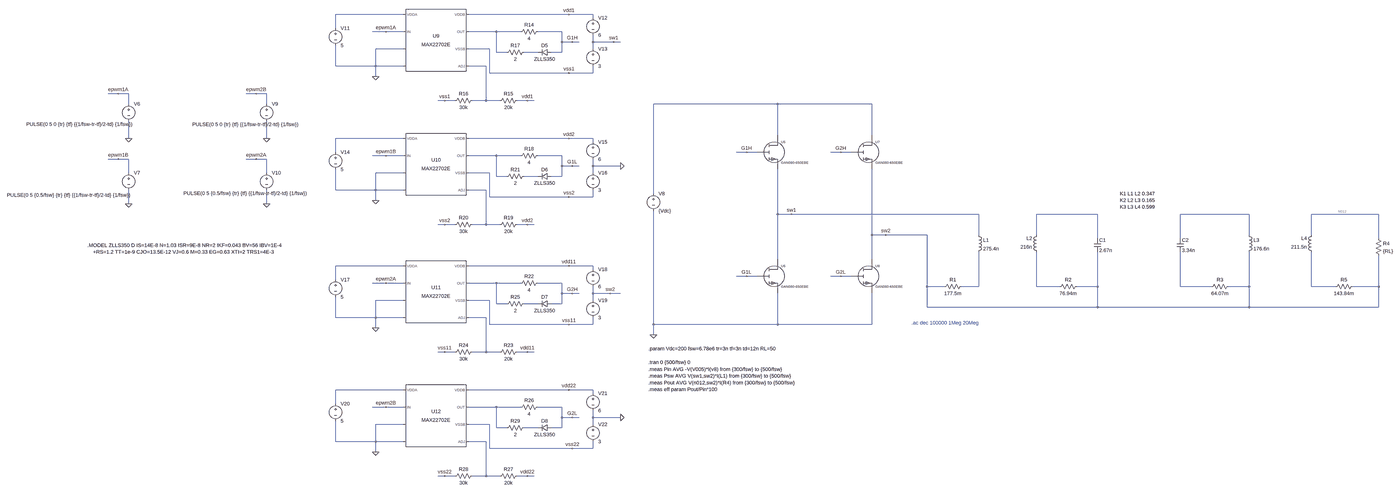
[diagram p0: schematic eta_coil_sim.asc, whole sheet]
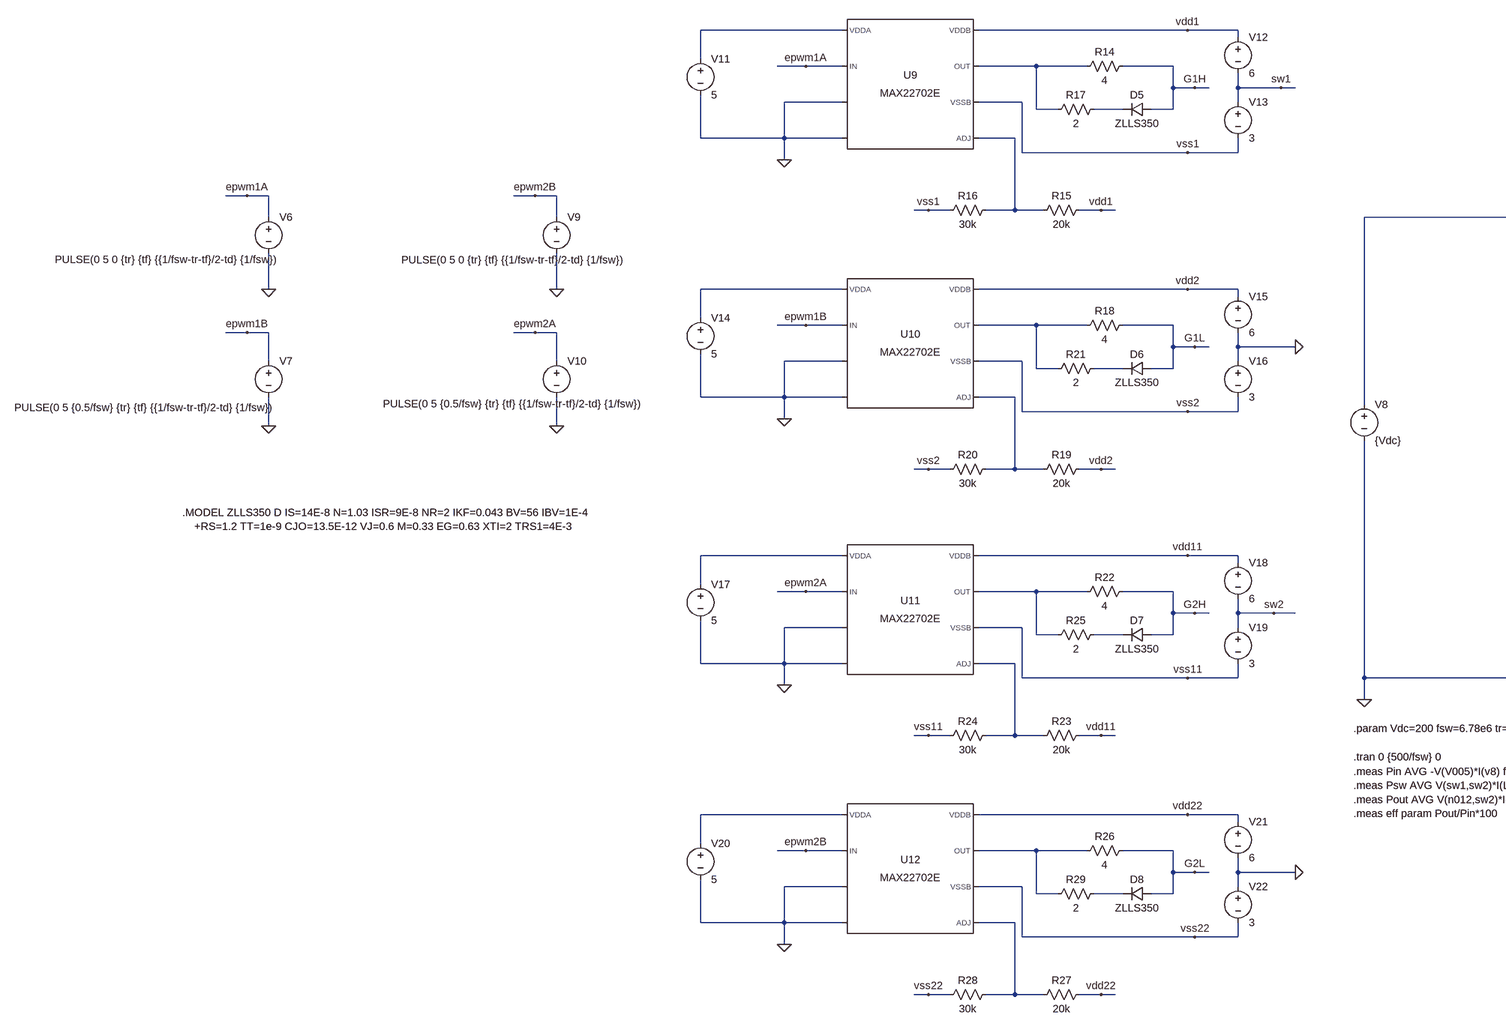
[diagram p1: schematic eta_coil_sim.asc, part, row 1 of 1, column 1 of 2]
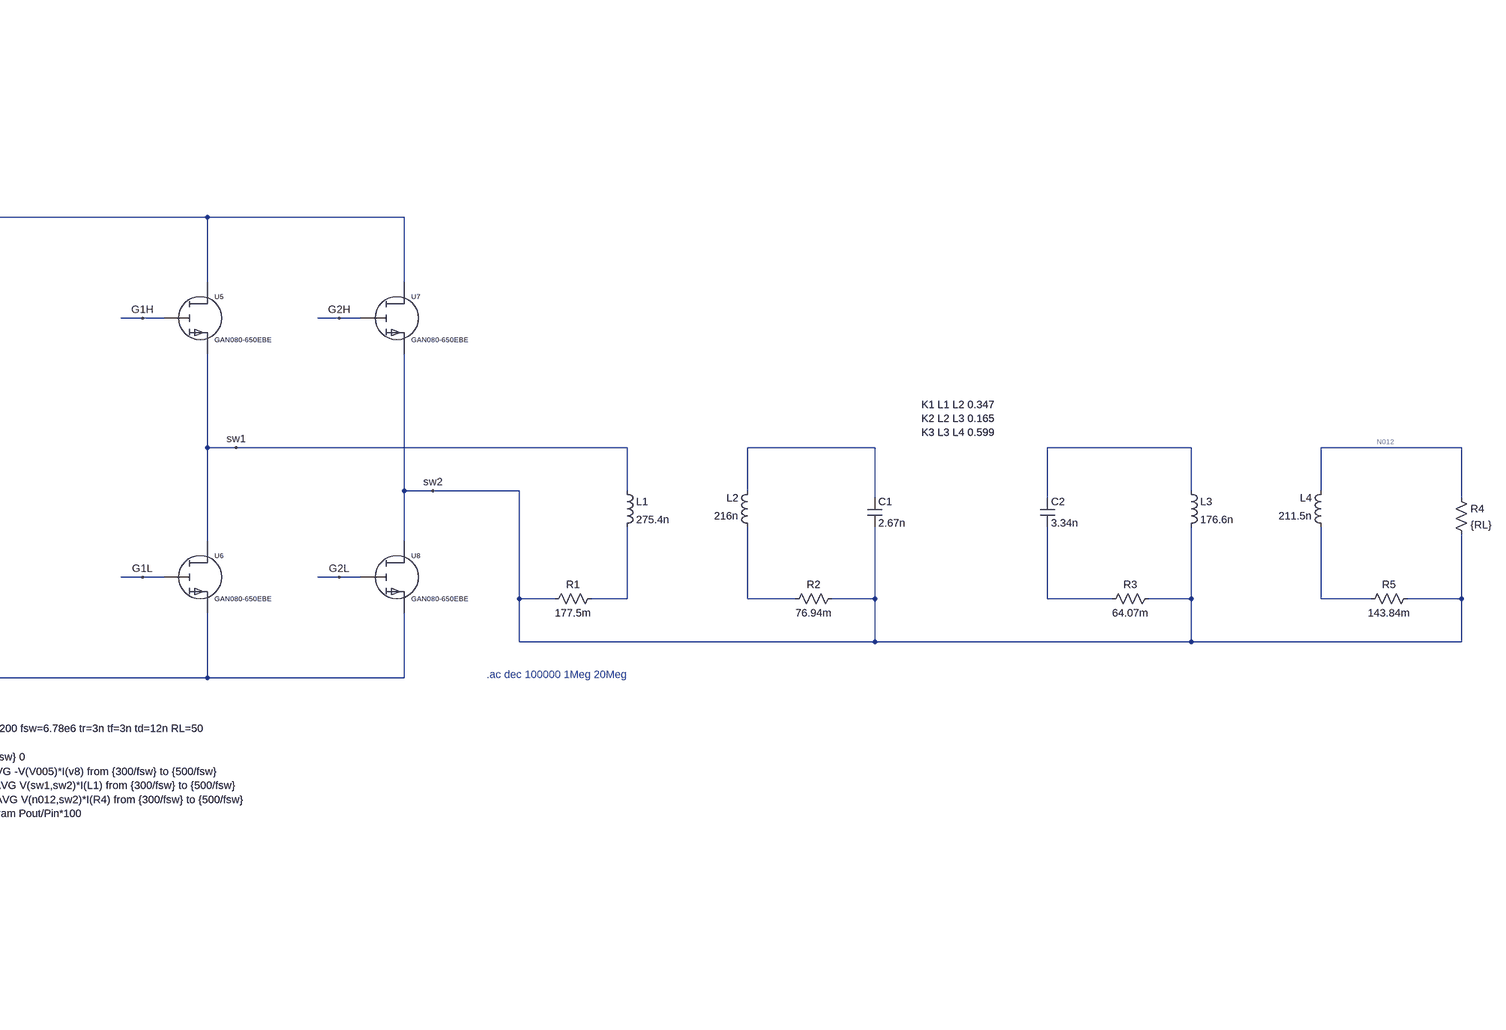
[diagram p2: schematic eta_coil_sim.asc, part, row 1 of 1, column 2 of 2]
eta_coil_sim.asc, the LTspice schematic file:
Version 4.1
SHEET 1 2552 808
WIRE -3744 -2960 -4080 -2960
WIRE -2976 -2960 -3440 -2960
WIRE -2864 -2960 -2976 -2960
WIRE -2864 -2944 -2864 -2960
WIRE -4080 -2896 -4080 -2960
WIRE -3824 -2880 -3888 -2880
WIRE -3744 -2880 -3824 -2880
WIRE -3312 -2880 -3440 -2880
WIRE -3200 -2880 -3312 -2880
WIRE -3008 -2880 -3120 -2880
WIRE -3008 -2832 -3008 -2880
WIRE -2960 -2832 -3008 -2832
WIRE -2928 -2832 -2960 -2832
WIRE -2864 -2832 -2864 -2864
WIRE -2768 -2832 -2864 -2832
WIRE -2736 -2832 -2768 -2832
WIRE -3744 -2800 -3872 -2800
WIRE -3344 -2800 -3440 -2800
WIRE -2864 -2800 -2864 -2832
WIRE -3312 -2784 -3312 -2880
WIRE -3264 -2784 -3312 -2784
WIRE -3120 -2784 -3184 -2784
WIRE -3008 -2784 -3008 -2832
WIRE -3008 -2784 -3056 -2784
WIRE -4080 -2720 -4080 -2816
WIRE -3872 -2720 -3872 -2800
WIRE -3872 -2720 -4080 -2720
WIRE -3744 -2720 -3872 -2720
WIRE -3360 -2720 -3440 -2720
WIRE -3344 -2688 -3344 -2800
WIRE -2976 -2688 -3344 -2688
WIRE -2864 -2688 -2864 -2720
WIRE -2864 -2688 -2976 -2688
WIRE -3872 -2672 -3872 -2720
WIRE -5456 -2592 -5504 -2592
WIRE -5408 -2592 -5456 -2592
WIRE -4816 -2592 -4864 -2592
WIRE -4768 -2592 -4816 -2592
WIRE -3552 -2560 -3584 -2560
WIRE -3504 -2560 -3552 -2560
WIRE -3360 -2560 -3360 -2720
WIRE -3360 -2560 -3424 -2560
WIRE -3296 -2560 -3360 -2560
WIRE -3168 -2560 -3216 -2560
WIRE -3136 -2560 -3168 -2560
WIRE -5408 -2544 -5408 -2592
WIRE -4768 -2544 -4768 -2592
WIRE -1824 -2544 -2400 -2544
WIRE -1280 -2544 -1824 -2544
WIRE -1824 -2400 -1824 -2544
WIRE -1280 -2400 -1280 -2544
WIRE -5408 -2384 -5408 -2464
WIRE -4768 -2384 -4768 -2464
WIRE -3744 -2384 -4080 -2384
WIRE -2976 -2384 -3440 -2384
WIRE -2864 -2384 -2976 -2384
WIRE -2864 -2368 -2864 -2384
WIRE -4080 -2320 -4080 -2384
WIRE -1968 -2320 -2016 -2320
WIRE -1920 -2320 -1968 -2320
WIRE -1424 -2320 -1472 -2320
WIRE -1376 -2320 -1424 -2320
WIRE -3824 -2304 -3888 -2304
WIRE -3744 -2304 -3824 -2304
WIRE -3312 -2304 -3440 -2304
WIRE -3200 -2304 -3312 -2304
WIRE -3008 -2304 -3120 -2304
WIRE -5456 -2288 -5504 -2288
WIRE -5408 -2288 -5456 -2288
WIRE -4816 -2288 -4864 -2288
WIRE -4768 -2288 -4816 -2288
WIRE -3008 -2256 -3008 -2304
WIRE -2960 -2256 -3008 -2256
WIRE -2928 -2256 -2960 -2256
WIRE -2864 -2256 -2864 -2288
WIRE -2736 -2256 -2864 -2256
WIRE -5408 -2224 -5408 -2288
WIRE -4768 -2224 -4768 -2288
WIRE -3744 -2224 -3872 -2224
WIRE -3344 -2224 -3440 -2224
WIRE -2864 -2224 -2864 -2256
WIRE -3312 -2208 -3312 -2304
WIRE -3264 -2208 -3312 -2208
WIRE -3120 -2208 -3184 -2208
WIRE -3008 -2208 -3008 -2256
WIRE -3008 -2208 -3056 -2208
WIRE -4080 -2144 -4080 -2240
WIRE -3872 -2144 -3872 -2224
WIRE -3872 -2144 -4080 -2144
WIRE -3744 -2144 -3872 -2144
WIRE -3360 -2144 -3440 -2144
WIRE -2400 -2128 -2400 -2544
WIRE -3344 -2112 -3344 -2224
WIRE -2976 -2112 -3344 -2112
WIRE -2864 -2112 -2864 -2144
WIRE -2864 -2112 -2976 -2112
WIRE -3872 -2096 -3872 -2144
WIRE -5408 -2080 -5408 -2144
WIRE -4768 -2080 -4768 -2144
WIRE -1824 -2032 -1824 -2240
WIRE -1760 -2032 -1824 -2032
WIRE -784 -2032 -1760 -2032
WIRE -80 -2032 -368 -2032
WIRE 624 -2032 304 -2032
WIRE 1296 -2032 912 -2032
WIRE -3552 -1984 -3584 -1984
WIRE -3504 -1984 -3552 -1984
WIRE -3360 -1984 -3360 -2144
WIRE -3360 -1984 -3424 -1984
WIRE -3296 -1984 -3360 -1984
WIRE -3168 -1984 -3216 -1984
WIRE -3136 -1984 -3168 -1984
WIRE -1280 -1936 -1280 -2240
WIRE -1216 -1936 -1280 -1936
WIRE -1024 -1936 -1216 -1936
WIRE -784 -1936 -784 -2032
WIRE -368 -1936 -368 -2032
WIRE 624 -1936 624 -2032
WIRE 912 -1936 912 -2032
WIRE -80 -1920 -80 -2032
WIRE 304 -1920 304 -2032
WIRE 1296 -1920 1296 -2032
WIRE -1824 -1824 -1824 -2032
WIRE -1280 -1824 -1280 -1936
WIRE -3744 -1792 -4080 -1792
WIRE -2976 -1792 -3440 -1792
WIRE -2864 -1792 -2976 -1792
WIRE -2864 -1776 -2864 -1792
WIRE -1968 -1744 -2016 -1744
WIRE -1920 -1744 -1968 -1744
WIRE -1424 -1744 -1472 -1744
WIRE -1376 -1744 -1424 -1744
WIRE -4080 -1728 -4080 -1792
WIRE -3824 -1712 -3888 -1712
WIRE -3744 -1712 -3824 -1712
WIRE -3312 -1712 -3440 -1712
WIRE -3200 -1712 -3312 -1712
WIRE -3008 -1712 -3120 -1712
WIRE -1024 -1696 -1024 -1936
WIRE -944 -1696 -1024 -1696
WIRE -784 -1696 -784 -1856
WIRE -784 -1696 -864 -1696
WIRE -368 -1696 -368 -1856
WIRE -256 -1696 -368 -1696
WIRE -80 -1696 -80 -1856
WIRE -80 -1696 -176 -1696
WIRE 304 -1696 304 -1856
WIRE 448 -1696 304 -1696
WIRE 624 -1696 624 -1856
WIRE 624 -1696 528 -1696
WIRE 912 -1696 912 -1856
WIRE 1072 -1696 912 -1696
WIRE 1296 -1696 1296 -1840
WIRE 1296 -1696 1152 -1696
WIRE -3008 -1664 -3008 -1712
WIRE -2960 -1664 -3008 -1664
WIRE -2928 -1664 -2960 -1664
WIRE -2864 -1664 -2864 -1696
WIRE -2784 -1664 -2864 -1664
WIRE -2736 -1664 -2784 -1664
WIRE -3744 -1632 -3872 -1632
WIRE -3344 -1632 -3440 -1632
WIRE -2864 -1632 -2864 -1664
WIRE -3312 -1616 -3312 -1712
WIRE -3264 -1616 -3312 -1616
WIRE -3120 -1616 -3184 -1616
WIRE -3008 -1616 -3008 -1664
WIRE -3008 -1616 -3056 -1616
WIRE -1024 -1600 -1024 -1696
WIRE -80 -1600 -80 -1696
WIRE -80 -1600 -1024 -1600
WIRE 624 -1600 624 -1696
WIRE 624 -1600 -80 -1600
WIRE 1296 -1600 1296 -1696
WIRE 1296 -1600 624 -1600
WIRE -4080 -1552 -4080 -1648
WIRE -3872 -1552 -3872 -1632
WIRE -3872 -1552 -4080 -1552
WIRE -3744 -1552 -3872 -1552
WIRE -3360 -1552 -3440 -1552
WIRE -3344 -1520 -3344 -1632
WIRE -2976 -1520 -3344 -1520
WIRE -2864 -1520 -2864 -1552
WIRE -2864 -1520 -2976 -1520
WIRE -2400 -1520 -2400 -2048
WIRE -1824 -1520 -1824 -1664
WIRE -1824 -1520 -2400 -1520
WIRE -1280 -1520 -1280 -1664
WIRE -1280 -1520 -1824 -1520
WIRE -3872 -1504 -3872 -1552
WIRE -2400 -1472 -2400 -1520
WIRE -3552 -1392 -3584 -1392
WIRE -3504 -1392 -3552 -1392
WIRE -3360 -1392 -3360 -1552
WIRE -3360 -1392 -3424 -1392
WIRE -3296 -1392 -3360 -1392
WIRE -3168 -1392 -3216 -1392
WIRE -3136 -1392 -3168 -1392
WIRE -3744 -1216 -4080 -1216
WIRE -2976 -1216 -3440 -1216
WIRE -2864 -1216 -2976 -1216
WIRE -2864 -1200 -2864 -1216
WIRE -4080 -1152 -4080 -1216
WIRE -3824 -1136 -3888 -1136
WIRE -3744 -1136 -3824 -1136
WIRE -3312 -1136 -3440 -1136
WIRE -3200 -1136 -3312 -1136
WIRE -3008 -1136 -3120 -1136
WIRE -3008 -1088 -3008 -1136
WIRE -2960 -1088 -3008 -1088
WIRE -2928 -1088 -2960 -1088
WIRE -2864 -1088 -2864 -1120
WIRE -2736 -1088 -2864 -1088
WIRE -3744 -1056 -3872 -1056
WIRE -3344 -1056 -3440 -1056
WIRE -2864 -1056 -2864 -1088
WIRE -3312 -1040 -3312 -1136
WIRE -3264 -1040 -3312 -1040
WIRE -3120 -1040 -3184 -1040
WIRE -3008 -1040 -3008 -1088
WIRE -3008 -1040 -3056 -1040
WIRE -4080 -976 -4080 -1072
WIRE -3872 -976 -3872 -1056
WIRE -3872 -976 -4080 -976
WIRE -3744 -976 -3872 -976
WIRE -3360 -976 -3440 -976
WIRE -3344 -944 -3344 -1056
WIRE -2960 -944 -3344 -944
WIRE -2864 -944 -2864 -976
WIRE -2864 -944 -2960 -944
WIRE -3872 -928 -3872 -976
WIRE -3552 -816 -3584 -816
WIRE -3504 -816 -3552 -816
WIRE -3360 -816 -3360 -976
WIRE -3360 -816 -3424 -816
WIRE -3296 -816 -3360 -816
WIRE -3168 -816 -3216 -816
WIRE -3136 -816 -3168 -816
FLAG -5456 -2592 epwm1A
FLAG -5456 -2288 epwm1B
FLAG -5408 -2384 0
FLAG -5408 -2080 0
FLAG -2400 -1472 0
FLAG -1968 -2320 G1H
FLAG -1968 -1744 G1L
FLAG -1424 -2320 G2H
FLAG -1424 -1744 G2L
FLAG -4816 -2288 epwm2A
FLAG -4816 -2592 epwm2B
FLAG -4768 -2384 0
FLAG -4768 -2080 0
FLAG -2960 -2832 G1H
FLAG -3824 -2880 epwm1A
FLAG -3872 -2672 0
FLAG -3552 -2560 vss1
FLAG -3168 -2560 vdd1
FLAG -2976 -2960 vdd1
FLAG -2960 -2256 G1L
FLAG -3824 -2304 epwm1B
FLAG -3872 -2096 0
FLAG -3168 -1984 vdd2
FLAG -2976 -2384 vdd2
FLAG -2960 -1664 G2H
FLAG -3824 -1712 epwm2A
FLAG -3872 -1504 0
FLAG -3552 -1392 vss11
FLAG -3168 -1392 vdd11
FLAG -2976 -1792 vdd11
FLAG -2960 -1088 G2L
FLAG -3824 -1136 epwm2B
FLAG -3872 -928 0
FLAG -3168 -816 vdd22
FLAG -2976 -1216 vdd22
FLAG -3552 -816 vss22
FLAG -2976 -2688 vss1
FLAG -2976 -2112 vss2
FLAG -2976 -1520 vss11
FLAG -2960 -944 vss22
FLAG -3552 -1984 vss2
FLAG -1760 -2032 sw1
FLAG -2768 -2832 sw1
FLAG -1216 -1936 sw2
FLAG -2784 -1664 sw2
FLAG -2736 -2256 0
FLAG -2736 -1088 0
SYMBOL ind -800 -1952 R0
SYMATTR InstName L1
SYMATTR Value 275.4n
SYMATTR Type ind
SYMBOL res -848 -1712 R90
WINDOW 0 0 56 VBottom 2
WINDOW 3 32 56 VTop 2
SYMATTR InstName R1
SYMATTR Value 177.5m
SYMBOL ind -352 -1840 R180
WINDOW 0 36 80 Left 2
WINDOW 3 36 40 Left 2
SYMATTR InstName L2
SYMATTR Value 216n
SYMATTR Type ind
SYMBOL cap -96 -1920 R0
SYMATTR InstName C1
SYMATTR Value 2.67n
SYMBOL res -160 -1712 R90
WINDOW 0 0 56 VBottom 2
WINDOW 3 32 56 VTop 2
SYMATTR InstName R2
SYMATTR Value 76.94m
SYMBOL cap 288 -1920 R0
SYMATTR InstName C2
SYMATTR Value 3.34n
SYMBOL ind 608 -1952 R0
SYMATTR InstName L3
SYMATTR Value 176.6n
SYMATTR Type ind
SYMBOL res 544 -1712 R90
WINDOW 0 0 56 VBottom 2
WINDOW 3 32 56 VTop 2
SYMATTR InstName R3
SYMATTR Value 64.07m
SYMBOL ind 928 -1840 R180
WINDOW 0 36 80 Left 2
WINDOW 3 36 40 Left 2
SYMATTR InstName L4
SYMATTR Value 211.5n
SYMATTR Type ind
SYMBOL res 1280 -1936 R0
SYMATTR InstName R4
SYMATTR Value {RL}
SYMBOL res 1168 -1712 R90
WINDOW 0 0 56 VBottom 2
WINDOW 3 32 56 VTop 2
SYMATTR InstName R5
SYMATTR Value 143.84m
SYMBOL voltage -5408 -2560 R0
WINDOW 123 0 0 Left 0
WINDOW 39 -273 152 Left 2
WINDOW 3 -475 110 Left 2
SYMATTR Value PULSE(0 5 0 {tr} {tf} {{1/fsw-tr-tf}/2-td} {1/fsw})
SYMATTR InstName V6
SYMBOL voltage -5408 -2240 R0
WINDOW 123 0 0 Left 0
WINDOW 39 -302 150 Left 2
WINDOW 3 -565 119 Left 2
SYMATTR Value PULSE(0 5 {0.5/fsw} {tr} {tf} {{1/fsw-tr-tf}/2-td} {1/fsw})
SYMATTR InstName V7
SYMBOL model\\GAN080-650EBE -1840 -2320 R0
SYMATTR InstName U5
SYMBOL model\\GAN080-650EBE -1840 -1744 R0
SYMATTR InstName U6
SYMBOL voltage -2400 -2144 R0
WINDOW 123 0 0 Left 0
WINDOW 39 0 0 Left 0
SYMATTR InstName V8
SYMATTR Value {Vdc}
SYMBOL model\\GAN080-650EBE -1296 -2320 R0
SYMATTR InstName U7
SYMBOL model\\GAN080-650EBE -1296 -1744 R0
SYMATTR InstName U8
SYMBOL voltage -4768 -2560 R0
WINDOW 123 0 0 Left 0
WINDOW 39 -273 152 Left 2
WINDOW 3 -345 111 Left 2
SYMATTR Value PULSE(0 5 0 {tr} {tf} {{1/fsw-tr-tf}/2-td} {1/fsw})
SYMATTR InstName V9
SYMBOL voltage -4768 -2240 R0
WINDOW 123 0 0 Left 0
WINDOW 39 -302 150 Left 2
WINDOW 3 -386 111 Left 2
SYMATTR Value PULSE(0 5 {0.5/fsw} {tr} {tf} {{1/fsw-tr-tf}/2-td} {1/fsw})
SYMATTR InstName V10
SYMBOL PowerProducts\\MAX22702E -3600 -2880 R0
SYMATTR InstName U9
SYMBOL diode -3056 -2800 R90
WINDOW 0 0 32 VBottom 2
WINDOW 3 32 32 VTop 2
SYMATTR InstName D5
SYMATTR Value ZLLS350
SYMBOL res -3104 -2896 R90
WINDOW 0 0 56 VBottom 2
WINDOW 3 32 56 VTop 2
SYMATTR InstName R14
SYMATTR Value 4
SYMBOL voltage -4080 -2912 R0
WINDOW 123 0 0 Left 0
WINDOW 39 0 0 Left 0
SYMATTR InstName V11
SYMATTR Value 5
SYMBOL res -3200 -2576 R90
WINDOW 0 0 56 VBottom 2
WINDOW 3 32 56 VTop 2
SYMATTR InstName R15
SYMATTR Value 20k
SYMBOL res -3408 -2576 R90
WINDOW 0 0 56 VBottom 2
WINDOW 3 32 56 VTop 2
SYMATTR InstName R16
SYMATTR Value 30k
SYMBOL voltage -2864 -2960 R0
WINDOW 123 0 0 Left 0
WINDOW 39 0 0 Left 0
SYMATTR InstName V12
SYMATTR Value 6
SYMBOL res -3168 -2800 R90
WINDOW 0 0 56 VBottom 2
WINDOW 3 32 56 VTop 2
SYMATTR InstName R17
SYMATTR Value 2
SYMBOL voltage -2864 -2816 R0
WINDOW 123 0 0 Left 0
WINDOW 39 0 0 Left 0
SYMATTR InstName V13
SYMATTR Value 3
SYMBOL PowerProducts\\MAX22702E -3600 -2304 R0
SYMATTR InstName U10
SYMBOL diode -3056 -2224 R90
WINDOW 0 0 32 VBottom 2
WINDOW 3 32 32 VTop 2
SYMATTR InstName D6
SYMATTR Value ZLLS350
SYMBOL res -3104 -2320 R90
WINDOW 0 0 56 VBottom 2
WINDOW 3 32 56 VTop 2
SYMATTR InstName R18
SYMATTR Value 4
SYMBOL voltage -4080 -2336 R0
WINDOW 123 0 0 Left 0
WINDOW 39 0 0 Left 0
SYMATTR InstName V14
SYMATTR Value 5
SYMBOL res -3200 -2000 R90
WINDOW 0 0 56 VBottom 2
WINDOW 3 32 56 VTop 2
SYMATTR InstName R19
SYMATTR Value 20k
SYMBOL res -3408 -2000 R90
WINDOW 0 0 56 VBottom 2
WINDOW 3 32 56 VTop 2
SYMATTR InstName R20
SYMATTR Value 30k
SYMBOL voltage -2864 -2384 R0
WINDOW 123 0 0 Left 0
WINDOW 39 0 0 Left 0
SYMATTR InstName V15
SYMATTR Value 6
SYMBOL res -3168 -2224 R90
WINDOW 0 0 56 VBottom 2
WINDOW 3 32 56 VTop 2
SYMATTR InstName R21
SYMATTR Value 2
SYMBOL voltage -2864 -2240 R0
WINDOW 123 0 0 Left 0
WINDOW 39 0 0 Left 0
SYMATTR InstName V16
SYMATTR Value 3
SYMBOL PowerProducts\\MAX22702E -3600 -1712 R0
SYMATTR InstName U11
SYMBOL diode -3056 -1632 R90
WINDOW 0 0 32 VBottom 2
WINDOW 3 32 32 VTop 2
SYMATTR InstName D7
SYMATTR Value ZLLS350
SYMBOL res -3104 -1728 R90
WINDOW 0 0 56 VBottom 2
WINDOW 3 32 56 VTop 2
SYMATTR InstName R22
SYMATTR Value 4
SYMBOL voltage -4080 -1744 R0
WINDOW 123 0 0 Left 0
WINDOW 39 0 0 Left 0
SYMATTR InstName V17
SYMATTR Value 5
SYMBOL res -3200 -1408 R90
WINDOW 0 0 56 VBottom 2
WINDOW 3 32 56 VTop 2
SYMATTR InstName R23
SYMATTR Value 20k
SYMBOL res -3408 -1408 R90
WINDOW 0 0 56 VBottom 2
WINDOW 3 32 56 VTop 2
SYMATTR InstName R24
SYMATTR Value 30k
SYMBOL voltage -2864 -1792 R0
WINDOW 123 0 0 Left 0
WINDOW 39 0 0 Left 0
SYMATTR InstName V18
SYMATTR Value 6
SYMBOL res -3168 -1632 R90
WINDOW 0 0 56 VBottom 2
WINDOW 3 32 56 VTop 2
SYMATTR InstName R25
SYMATTR Value 2
SYMBOL voltage -2864 -1648 R0
WINDOW 123 0 0 Left 0
WINDOW 39 0 0 Left 0
SYMATTR InstName V19
SYMATTR Value 3
SYMBOL PowerProducts\\MAX22702E -3600 -1136 R0
SYMATTR InstName U12
SYMBOL diode -3056 -1056 R90
WINDOW 0 0 32 VBottom 2
WINDOW 3 32 32 VTop 2
SYMATTR InstName D8
SYMATTR Value ZLLS350
SYMBOL res -3104 -1152 R90
WINDOW 0 0 56 VBottom 2
WINDOW 3 32 56 VTop 2
SYMATTR InstName R26
SYMATTR Value 4
SYMBOL voltage -4080 -1168 R0
WINDOW 123 0 0 Left 0
WINDOW 39 0 0 Left 0
SYMATTR InstName V20
SYMATTR Value 5
SYMBOL res -3200 -832 R90
WINDOW 0 0 56 VBottom 2
WINDOW 3 32 56 VTop 2
SYMATTR InstName R27
SYMATTR Value 20k
SYMBOL res -3408 -832 R90
WINDOW 0 0 56 VBottom 2
WINDOW 3 32 56 VTop 2
SYMATTR InstName R28
SYMATTR Value 30k
SYMBOL voltage -2864 -1216 R0
WINDOW 123 0 0 Left 0
WINDOW 39 0 0 Left 0
SYMATTR InstName V21
SYMATTR Value 6
SYMBOL res -3168 -1056 R90
WINDOW 0 0 56 VBottom 2
WINDOW 3 32 56 VTop 2
SYMATTR InstName R29
SYMATTR Value 2
SYMBOL voltage -2864 -1072 R0
WINDOW 123 0 0 Left 0
WINDOW 39 0 0 Left 0
SYMATTR InstName V22
SYMATTR Value 3
TEXT 24 -2128 Left 2 !K1 L1 L2 0.347\nK2 L2 L3 0.165\nK3 L3 L4 0.599
TEXT -1096 -1528 Left 2 ;.ac dec 100000 1Meg 20Meg
TEXT -5600 -1888 Left 2 !.MODEL ZLLS350 D IS=14E-8 N=1.03 ISR=9E-8 NR=2 IKF=0.043 BV=56 IBV=1E-4\n    +RS=1.2 TT=1e-9 CJO=13.5E-12 VJ=0.6 M=0.33 EG=0.63 XTI=2 TRS1=4E-3
TEXT -2424 -1408 Left 2 !.param Vdc=200 fsw=6.78e6 tr=3n tf=3n td=12n RL=50
TEXT -2424 -1344 Left 2 !.tran 0 {500/fsw} 0
TEXT -2424 -1312 Left 2 !.meas Pin AVG -V(V005)*I(v8) from {300/fsw} to {500/fsw}\n.meas Psw AVG V(sw1,sw2)*I(L1) from {300/fsw} to {500/fsw}\n.meas Pout AVG V(n012,sw2)*I(R4) from {300/fsw} to {500/fsw}\n.meas eff param Pout/Pin*100

The netlist it stands for:
* eta_coil_sim.asc
L1 sw1 N015 275.4n
R1 N015 sw2 177.5m
L2 N016 N010 216n
C1 N010 sw2 2.67n
R2 sw2 N016 76.94m
C2 N011 N017 3.34n
L3 N011 sw2 176.6n
R3 sw2 N017 64.07m
L4 N018 N012 211.5n
R4 N012 sw2 {RL}
R5 sw2 N018 143.84m
V6 epwm1A 0 PULSE(0 5 0 {tr} {tf} {{1/fsw-tr-tf}/2-td} {1/fsw})
V7 epwm1B 0 PULSE(0 5 {0.5/fsw} {tr} {tf} {{1/fsw-tr-tf}/2-td} {1/fsw})
X§U5 N005 G1H sw1 GAN080-650EBE  ; pins Drain Gate Source
X§U6 sw1 G1L 0 GAN080-650EBE  ; pins Drain Gate Source
V8 N005 0 {Vdc}
X§U7 N005 G2H sw2 GAN080-650EBE  ; pins Drain Gate Source
X§U8 sw2 G2L 0 GAN080-650EBE  ; pins Drain Gate Source
V9 epwm2B 0 PULSE(0 5 0 {tr} {tf} {{1/fsw-tr-tf}/2-td} {1/fsw})
V10 epwm2A 0 PULSE(0 5 {0.5/fsw} {tr} {tf} {{1/fsw-tr-tf}/2-td} {1/fsw})
X§U9 N001 epwm1A 0 0 vdd1 N002 N004 vss1 MAX22702E  ; pins VDDA IN ? ? VDDB OUT ADJ VSSB
D5 G1H N003 ZLLS350
R14 G1H N002 4
V11 N001 0 5
R15 vdd1 N004 20k
R16 N004 vss1 30k
V12 vdd1 sw1 6
R17 N003 N002 2
V13 sw1 vss1 3
X§U10 N006 epwm1B 0 0 vdd2 N007 N009 vss2 MAX22702E  ; pins VDDA IN ? ? VDDB OUT ADJ VSSB
D6 G1L N008 ZLLS350
R18 G1L N007 4
V14 N006 0 5
R19 vdd2 N009 20k
R20 N009 vss2 30k
V15 vdd2 0 6
R21 N008 N007 2
V16 0 vss2 3
X§U11 N013 epwm2A 0 0 vdd11 N014 N020 vss11 MAX22702E  ; pins VDDA IN ? ? VDDB OUT ADJ VSSB
D7 G2H N019 ZLLS350
R22 G2H N014 4
V17 N013 0 5
R23 vdd11 N020 20k
R24 N020 vss11 30k
V18 vdd11 sw2 6
R25 N019 N014 2
V19 sw2 vss11 3
X§U12 N021 epwm2B 0 0 vdd22 N022 N024 vss22 MAX22702E  ; pins VDDA IN ? ? VDDB OUT ADJ VSSB
D8 G2L N023 ZLLS350
R26 G2L N022 4
V20 N021 0 5
R27 vdd22 N024 20k
R28 N024 vss22 30k
V21 vdd22 0 6
R29 N023 N022 2
V22 0 vss22 3
.model D D
.lib standard.dio
K1 L1 L2 0.347
K2 L2 L3 0.165
K3 L3 L4 0.599
* .ac dec 100000 1Meg 20Meg
.MODEL ZLLS350 D IS=14E-8 N=1.03 ISR=9E-8 NR=2 IKF=0.043 BV=56 IBV=1E-4
    +RS=1.2 TT=1e-9 CJO=13.5E-12 VJ=0.6 M=0.33 EG=0.63 XTI=2 TRS1=4E-3
.param Vdc=200 fsw=6.78e6 tr=3n tf=3n td=12n RL=50
.tran 0 {500/fsw} 0
.meas Pin AVG -V(V005)*I(v8) from {300/fsw} to {500/fsw}
.meas Psw AVG V(sw1,sw2)*I(L1) from {300/fsw} to {500/fsw}
.meas Pout AVG V(n012,sw2)*I(R4) from {300/fsw} to {500/fsw}
.meas eff param Pout/Pin*100
.lib GAN080-650EBE_LTspice.lib
.lib MAX22702E.sub
.backanno
.end